# Altium project CPU_Board.PrjPCB (part 1 of 2)
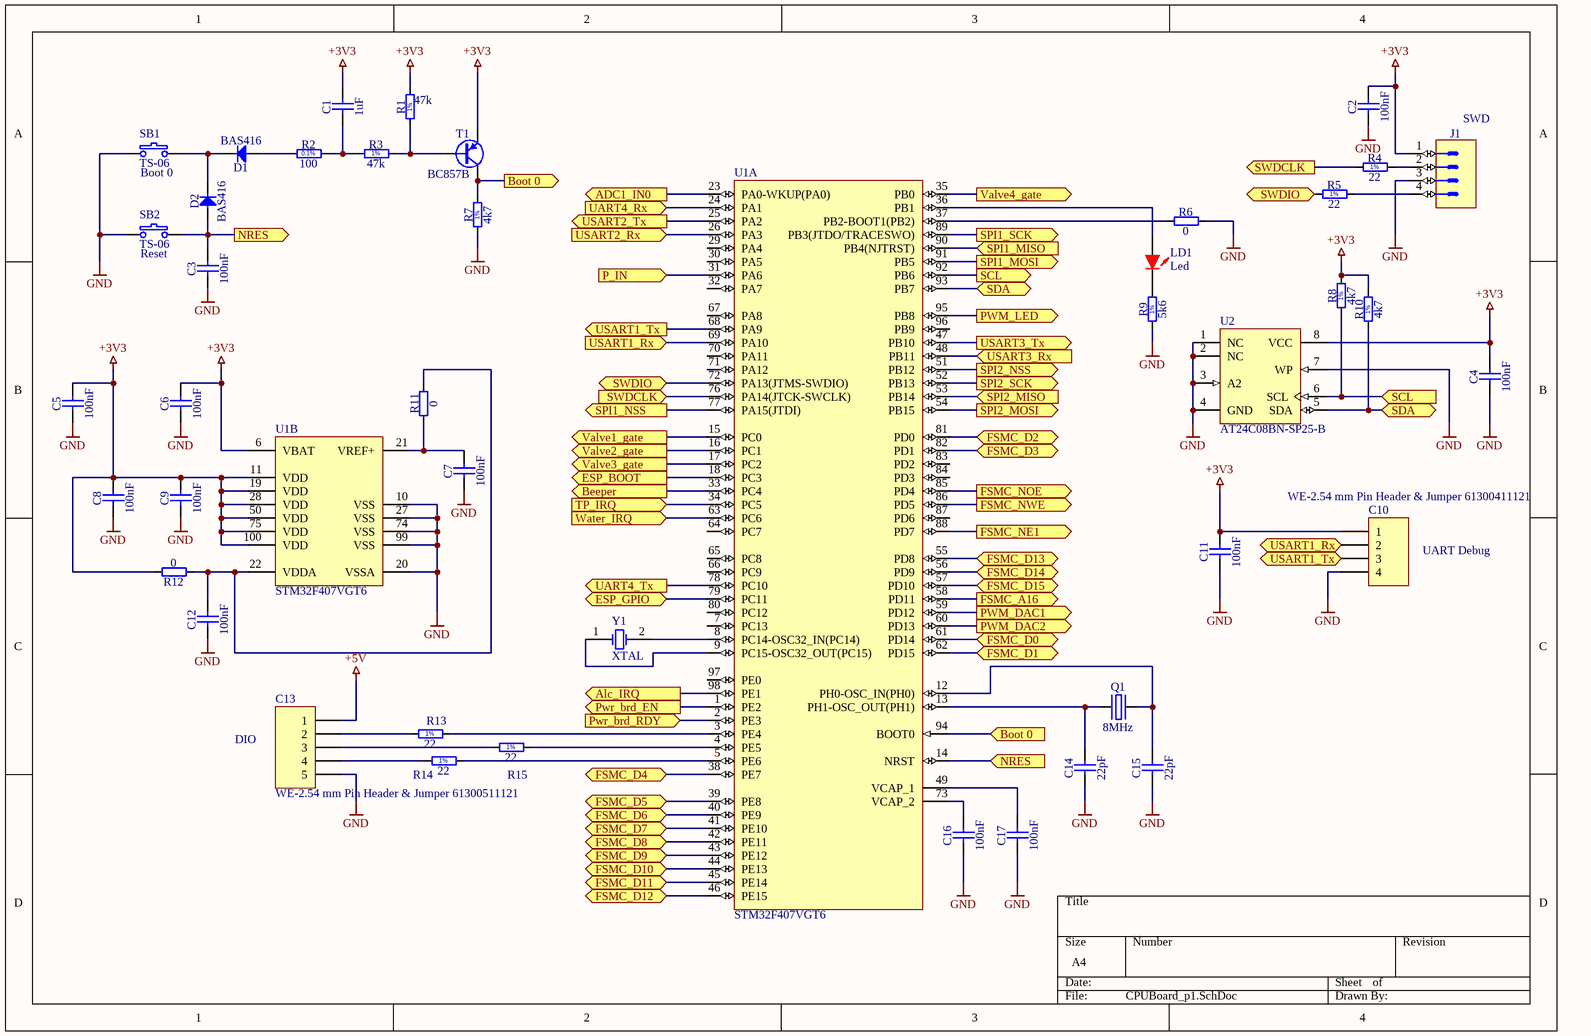
[diagram p0: CPUBoard_p1.SchDoc]
3 sheets, 146 parts. Net scope: flat (ports and power ports of the same name join across sheets).
Board file: Control_CPUBoard_PCB.PcbDoc
Sheets:
  CPUBoard_p1.SchDoc
  CPUBoard_p2.SchDoc
  CPUBoard_p3.SchDoc

## Sheet CPUBoard_p1.SchDoc
size A4

### Parts
C1  1uF  [CAPC2012X140N]
C2  100nF  [CAPC2012X135N]
C3  100nF  [CAPC2012X135N]
C4  100nF  [CAPC2012X135N]
C5  100nF  [CAPC2012X135N]
C6  100nF  [CAPC2012X135N]
C7  100nF  [CAPC2012X135N]
C8  100nF  [CAPC2012X135N]
C9  100nF  [CAPC2012X135N]
C10  WE-2.54 mm Pin Header & Jumper 61300411121  [61300411121]
C11  100nF  [CAPC2012X135N]
C12  100nF  [CAPC2012X135N]
C13  WE-2.54 mm Pin Header & Jumper 61300511121  [61300511121]
C14  22pF  [CAPC2012X135N]
C15  22pF  [CAPC2012X135N]
C16  100nF  [CAPC2012X135N]
C17  100nF  [CAPC2012X135N]
D1  BAS416  [SOD2512X110N]
D2  BAS416  [SOD2512X110N]
J1  KK®  [MOLEX_22-27-2041]  (value not drawn)
LD1  Led  [Led 0805-Red]
Q1  8MHz  [XTAL_HC-49/U-S]
R1  47k  [RESC2012X60N]
R2  100  [RESC2012X60N]
R3  47k  [RESC2012X60N]
R4  22  [RESC2012X60N]
R5  22  [RESC2012X60N]
R6  0  [RESC2012X60N]
R7  4k7  [RESC2012X60N]
R8  4k7  [RESC2012X60N]
R9  5k6  [RESC2012X60N]
R10  4k7  [RESC2012X60N]
R11  0  [RESC2012X60N]
R12  0  [RESC2012X60N]
R13  22  [RESC2012X60N]
R14  22  [RESC2012X60N]
R15  22  [RESC2012X60N]
SB1  TS-06  [TS-06]
SB2  TS-06  [TS-06]
T1  BC857B  [SOT95P230X110-3N]
U1  STM32F407VGT6  [STM-LQFP100_N]  (parts A,B of 2)
U2  AT24C08BN-SP25-B  [8S1_N]
Y1  XTAL  [R38]

### Ports
ADC1_IN0 (out), Alc_IRQ (out), Beeper (out), Boot 0 (in), Boot 0 (out), ESP_BOOT (out), ESP_GPIO (bidir), FSMC_A16 (out), FSMC_D0 (bidir), FSMC_D1 (bidir), FSMC_D2 (bidir), FSMC_D3 (bidir), FSMC_D4 (bidir), FSMC_D5 (bidir), FSMC_D6 (bidir), FSMC_D7 (bidir), FSMC_D8 (bidir), FSMC_D9 (bidir), FSMC_D10 (bidir), FSMC_D11 (bidir), FSMC_D12 (bidir), FSMC_D13 (bidir), FSMC_D14 (bidir), FSMC_D15 (bidir), FSMC_NE1 (out), FSMC_NOE (out), FSMC_NWE (out), NRES (in), NRES (out), P_IN (in), PWM_DAC1 (out), PWM_DAC2 (out), PWM_LED (out), Pwr_brd_EN (out), Pwr_brd_RDY (in), SCL (in), SCL (out), SDA (bidir), SPI1_MISO (in), SPI1_MOSI (out), SPI1_NSS (out), SPI1_SCK (out), SPI2_MISO (in), SPI2_MOSI (out), SPI2_NSS (out), SPI2_SCK (out), SWDCLK (in), SWDCLK (out), SWDIO (bidir), TP_IRQ (in), UART4_Rx (in), UART4_Tx (out), USART1_Rx (in), USART1_Rx (out), USART1_Tx (in), USART1_Tx (out), USART2_Rx (in), USART2_Tx (out), USART3_Rx (in), USART3_Tx (out), Valve1_gate (out), Valve2_gate (out), Valve3_gate (out), Valve4_gate (out), Water_IRQ (in)

### Nets
+3V3: C1.2 C2.2 C4.2 C5.2 C6.2 C8.2 C9.2 C10.1 C11.2 J1.1 R1.2 R8.2 R10.2 R12.2 T1.2(E) U1.6(VBAT) U1.11(VDD) U1.19(VDD) U1.28(VDD) U1.50(VDD) U1.75(VDD) U1.100(VDD) U2.8(VCC)
+5V: C13.1
GND: C2.1 C3.1 C4.1 C5.1 C6.1 C7.1 C8.1 C9.1 C10.4 C11.1 C12.1 C13.5 C14.1 C15.1 C16.1 C17.1 J1.3 R6.2 R7.1 R9.1 SB1.1 SB2.1 U1.10(VSS) U1.20(VSSA) U1.27(VSS) U1.74(VSS) U1.99(VSS) U2.1(NC) U2.2(NC) U2.3(A2) U2.4(GND) U2.7(WP)
NetC1_1: C1.1 R2.2 R3.1
NetC3_2: C3.2 D2.2(A) SB2.2 U1.14(NRST) ; port NRES
NetC7_2: C7.2 R11.1 U1.21(VREF+)
NetC10_2: C10.2 U1.69(PA10) ; port USART1_Rx
NetC10_3: C10.3 U1.68(PA9) ; port USART1_Tx
NetC12_2: C12.2 R11.2 R12.1 U1.22(VDDA)
NetC13_2: C13.2 R13.1
NetC13_3: C13.3 R15.1
NetC13_4: C13.4 R14.1
NetC14_2: C14.2 Q1.1(OSC1) U1.13(PH1-OSC_OUT(PH1))
NetC15_2: C15.2 Q1.2(OSC2) U1.12(PH0-OSC_IN(PH0))
NetC16_2: C16.2 U1.73(VCAP_2)
NetC17_2: C17.2 U1.49(VCAP_1)
NetC20_2: U1.23(PA0-WKUP(PA0)) ; port ADC1_IN0
NetD1_1: D1.1(C) D2.1(C) SB1.2
NetD1_2: D1.2(A) R2.1
NetD4_1: U1.25(PA2) ; port USART2_Tx
NetD4_2: U1.26(PA3) ; port USART2_Rx
NetH2_2: U1.61(PD14) ; port FSMC_D0
NetH2_4: U1.62(PD15) ; port FSMC_D1
NetH2_6: U1.81(PD0) ; port FSMC_D2
NetH2_7: U1.58(PD11) ; port FSMC_A16
NetH2_8: U1.82(PD1) ; port FSMC_D3
NetH2_9: U1.86(PD5) ; port FSMC_NWE
NetH2_10: U1.38(PE7) ; port FSMC_D4
NetH2_11: U1.85(PD4) ; port FSMC_NOE
NetH2_12: U1.39(PE8) ; port FSMC_D5
NetH2_13: U1.42(PE11) ; port FSMC_D8
NetH2_14: U1.40(PE9) ; port FSMC_D6
NetH2_15: U1.43(PE12) ; port FSMC_D9
NetH2_16: U1.41(PE10) ; port FSMC_D7
NetH2_17: U1.44(PE13) ; port FSMC_D10
NetH2_18: U1.89(PB3(JTDO/TRACESWO)) ; port SPI1_SCK
NetH2_19: U1.45(PE14) ; port FSMC_D11
NetH2_20: U1.77(PA15(JTDI)) ; port SPI1_NSS
NetH2_21: U1.46(PE15) ; port FSMC_D12
NetH2_22: U1.91(PB5) ; port SPI1_MOSI
NetH2_23: U1.55(PD8) ; port FSMC_D13
NetH2_25: U1.56(PD9) ; port FSMC_D14
NetH2_26: U1.90(PB4(NJTRST)) ; port SPI1_MISO
NetH2_27: U1.57(PD10) ; port FSMC_D15
NetH2_28: U1.34(PC5) ; port TP_IRQ
NetH2_29: U1.88(PD7) ; port FSMC_NE1
NetH3_1: U1.24(PA1) ; port UART4_Rx
NetH3_4: U1.79(PC11) ; port ESP_GPIO
NetH3_6: U1.18(PC3) ; port ESP_BOOT
NetH3_8: U1.78(PC10) ; port UART4_Tx
NetIC1_6: U1.31(PA6) ; port P_IN
NetJ1_2: J1.2 R4.2
NetJ1_4: J1.4 R5.2
NetJ6_4: U1.15(PC0) ; port Valve1_gate
NetJ6_5: U1.16(PC1) ; port Valve2_gate
NetJ6_6: U1.17(PC2) ; port Valve3_gate
NetJ6_7: U1.35(PB0) ; port Valve4_gate
NetLD1_1: LD1.1(A) U1.36(PB1)
NetLD1_2: LD1.2(K) R9.2
NetR1_1: R1.1 R3.2 T1.1(B)
NetR4_1: R4.1 U1.76(PA14(JTCK-SWCLK)) ; port SWDCLK
NetR5_1: R5.1 U1.72(PA13(JTMS-SWDIO)) ; port SWDIO
NetR6_1: R6.1 U1.37(PB2-BOOT1(PB2))
NetR7_2: R7.2 T1.3(C) U1.94(BOOT0) ; port Boot 0
NetR8_1: R8.1 U1.92(PB6) U2.6(SCL) ; port SCL
NetR10_1: R10.1 U1.93(PB7) U2.5(SDA) ; port SDA
NetR13_2: R13.2 U1.3(PE4)
NetR14_2: R14.2 U1.5(PE6)
NetR15_2: R15.2 U1.4(PE5)
NetR18_1: U1.98(PE1) ; port Alc_IRQ
NetR21_1: U1.63(PC6) ; port Water_IRQ
NetR25_1: U1.60(PD13) ; port PWM_DAC2
NetR29_1: U1.48(PB11) ; port USART3_Rx
NetR30_1: U1.2(PE3) ; port Pwr_brd_RDY
NetR31_1: U1.47(PB10) ; port USART3_Tx
NetR32_1: U1.95(PB8) ; port PWM_LED
NetR33_1: U1.33(PC4) ; port Beeper
NetR34_1: U1.1(PE2) ; port Pwr_brd_EN
NetR49_1: U1.59(PD12) ; port PWM_DAC1
NetU1_8: U1.8(PC14-OSC32_IN(PC14)) Y1.2(OSC2)
NetU1_9: U1.9(PC15-OSC32_OUT(PC15)) Y1.1(OSC1)
NetU1_51: U1.51(PB12) ; port SPI2_NSS
NetU1_52: U1.52(PB13) ; port SPI2_SCK
NetU1_53: U1.53(PB14) ; port SPI2_MISO
NetU1_54: U1.54(PB15) ; port SPI2_MOSI

Not connected (* = marked no-connect by the designer): U1 7(PC13) 29(PA4) 30(PA5) 32(PA7) 64(PC7) 65(PC8) 66(PC9) 67(PA8) 70(PA11) 71(PA12) 80(PC12) 83(PD2) 84(PD3) 87(PD6) 96(PB9) 97(PE0)

### Notes on the sheet
- (near SB1) Boot 0
- (near J1) SWD
- (near SB2) Reset
- UART Debug
- DIO
- (in symbol R0805_4K7_1%_0.125W_100PPM) 1%
- (in symbol R0805_5K6_1%_0.125W_100PPM) 1%
- (in symbol R0805_22R_1%_0.125W_100PPM) 1%
- (in symbol R0805_47K_1%_0.125W_100PPM) 1%
- (in symbol R0805_100R_0.1%_0.1W_10PPM) 0.1%

### Library data of the parts
C1 = CC0805_1UF_35V_20%_X7R: Non-polarised capacitor; Part Description: SMD Multilayer Chip Ceramic Capacitor; Manufacturer: GENERIC; Manufacturer1 Part Number: GMK212B7105MG-T; Voltage: 35V; TC: X7R; Tolerance: ±20%; Table: Capacitors SMD; Part Number: CC0805_1UF_35V_20%_X7R; Component Kind: Standard; Component Type: Standard; Pin Count: 2; Value: 1uF; Status: Not Recommended; Manufacturer Part Number: CC0805_1UF_35V_20%_X7R; Case: 0805; Mounted: Yes; Socket: No; SMD: Yes; Manufacturer1 Example: TAIYO YUDEN; Manufacturer1 ComponentHeight: 1.35mm; HelpURL: \\cern.ch\dfs\Applications\Altium\Datasheets\CC0805_X7R_TAIYO-YUDEN_HIGH-VALUE.pdf; Author: CERN DEM JLC; CreateDate: 22.06.2011; LatestRevisionDate: 22.06.2011
C2-C9 C11 C12 C16 C17 = CC0805_100NF_50V_10%_X7R: Non-polarised capacitor; Part Description: SMD Multilayer Chip Ceramic Capacitor; Manufacturer: GENERIC; Manufacturer1 Part Number: B37941K5104K62; Voltage: 50V; TC: X7R; Tolerance: ±10%; Table: Capacitors SMD; Part Number: CC0805_100NF_50V_10%_X7R; Component Kind: Standard; Component Type: Standard; Pin Count: 2; Value: 100nF; Status: Preferred; Manufacturer Part Number: CC0805_100NF_50V_10%_X7R; Case: 0805; Mounted: Yes; Socket: No; SMD: Yes; Manufacturer1 Example: EPCOS; Manufacturer1 ComponentHeight: 1.35mm; HelpURL: \\cern.ch\dfs\Applications\Altium\Datasheets\CC0805_X7R_EPCOS.pdf; Author: CERN DEM JLC; CreateDate: 03.12.2007; LatestRevisionDate: 03.12.2007
C10 = WE-2.54 mm Pin Header & Jumper 61300411121: WR-PHD 2.54mm Pin Header; Manufacturer: WЁ№rth Elektronik eiSos GmbH; ComponentLink1 Description: Manufacturer; ComponentLink2 Description: Datasheet; NoPins: 04; Created Date: 22 March 2013; partNo: 61300411121; ComponentLink1URL: http://www.we-online.com; ComponentLink2URL: http://katalog.we-online.de/em/datasheet/6130xx11121.pdf; Created by: Karrer Zheng
C13 = WE-2.54 mm Pin Header & Jumper 61300511121: WR-PHD 2.54mm Pin Header; Manufacturer: WЁ№rth Elektronik eiSos GmbH; ComponentLink1 Description: Manufacturer; ComponentLink2 Description: Datasheet; NoPins: 05; Created Date: 22 March 2013; partNo: 61300511121; ComponentLink1URL: http://www.we-online.com; ComponentLink2URL: http://katalog.we-online.de/em/datasheet/6130xx11121.pdf; Created by: Karrer Zheng
C14 C15 = CC0805_22PF_50V_5%_NP0: Non-polarised capacitor; Part Description: SMD Multilayer Chip Ceramic Capacitor; Manufacturer: GENERIC; Manufacturer1 Part Number: 223886115229; Voltage: 50V; TC: NP0; Tolerance: ±5%; Table: Capacitors SMD; Part Number: CC0805_22PF_50V_5%_NP0; Component Kind: Standard; Component Type: Standard; Pin Count: 2; Value: 22pF; Status: Preferred; Manufacturer Part Number: CC0805_22PF_50V_5%_NP0; Case: 0805; Mounted: Yes; Socket: No; SMD: Yes; Manufacturer1 Example: PHYCOMP; Manufacturer1 ComponentHeight: 1.35mm; HelpURL: \\cern.ch\dfs\Applications\Altium\Datasheets\CC0805_NP0_PHYCOMP.pdf; Author: CERN DEM JLC; CreateDate: 03.12.2007; LatestRevisionDate: 03.12.2007
D1 D2 = BAS416: Diode; Part Description: Low-Leakage Diode; Manufacturer: NXP SEMICONDUCTORS; Voltage: 75V; Power: 200mA; Table: Diodes; Part Number: BAS416; Component Kind: Standard; Component Type: Standard; Device: BAS416; PackageDescription: Small Outline Diode Flat Lead (SOD-323), 1.70mm W X 1.25mm L X 1.10mm H body,  IPC Medium Density; Manufacturer Part Number: BAS416; Pin Count: 2; Case: SOD323; Mounted: Yes; Socket: No; SMD: Yes; ComponentHeight: 1.1mm; HelpURL: \\cern.ch\dfs\Applications\Altium\Datasheets\BAS416.pdf; Author: CERN DEM JLC; CreateDate: 01.10.2013; LatestRevisionDate: 01.10.2013
J1 = MOLEX_22-27-2041: Connector 4 Male; Part Description: 2.54mm (.100") Pitch KK® Wire-to-Board Header, Vertical, with Friction Lock, 4 Circuits, Tin (Sn) Plating; Manufacturer: MOLEX; Part Number: MOLEX_22-27-2041; Component Kind: Standard; Component Type: Standard; Pin Count: 4; Family: KK®; Mounted: Yes; Socket: No; SMD: No; Status: None; Manufacturer Part Number: 22-27-2041; ComponentHeight: 11.7mm; HelpURL: \\cern.ch\dfs\Applications\Altium\Datasheets\MOLEX_22-27-2041.pdf; Author: CERN DEM JLC; CreateDate: 04.12.2008; LatestRevisionDate: 04.12.2008; Table: MOLEX
LD1 = Led 0805 KP-2012EC: Red  627nm 12mcd; Price: 0.09
Q1 = XTAL_5MHZ_CITIZEN_HC49US5.000MABJ-UB: Quartz Crystal; Part Description: Tolerance:± 30ppm, Stability:± 50ppm, -10°C to +60°C, 18pF, Quartz Crystal, HC-49/U-S Serie; Manufacturer: CITIZEN FINETECH MIYOTA CO; Table: Crystals & Oscillators; Part Number: XTAL_5MHZ_CITIZEN_HC49US5.000MABJ-UB; Component Kind: Standard; Component Type: Standard; PackageDescription: HC-49/U-S Leaded Cristal, Body 11.5x4.66mm; Pitch 4.88mm; Value: 8MHz; Manufacturer Part Number: HC49US5.000MABJ-UB; Pin Count: 2; Mounted: Yes; Socket: No; SMD: No; ComponentHeight: 3.5mm; HelpURL: \\cern.ch\dfs\Applications\Altium\Datasheets\XTAL_CITIZEN_HC-49-U-S.pdf; Author: CERN DEM JLC; CreateDate: 27.11.2012; LatestRevisionDate: 27.11.2012
R1 R3 = R0805_47K_1%_0.125W_100PPM: Resistor - 1%; Part Description: General Purpose Thick Film Chip Resistor; Manufacturer: GENERIC; Manufacturer1 Part Number: NRC10F4702TRF; Power: 0.125W; TC: ±100ppm/°C; Table: Resistors SMD; Part Number: R0805_47K_1%_0.125W_100PPM; Component Kind: Standard; Component Type: Standard; Pin Count: 2; Value: 47k; Status: Preferred; Tolerance: ±1%; Manufacturer Part Number: R0805_47K_1%_0.125W_100PPM; Case: 0805; Mounted: Yes; Socket: No; SMD: Yes; Manufacturer1 Example: NIC COMPONENT; Manufacturer1 ComponentHeight: 0.6mm; HelpURL: \\cern.ch\dfs\Applications\Altium\Datasheets\R0805_NIC_NRC.pdf; Author: CERN DEM JLC; CreateDate: 03.12.2007; LatestRevisionDate: 13.03.2008
R2 = R0805_100R_0.1%_0.1W_10PPM: Resistor - 0.1%; Part Description: Thin Film Chip Resistor; Manufacturer: GENERIC; Manufacturer1 Part Number: RN73C2A100RBTG; Power: 0.1W; TC: ±10ppm; Table: Resistors SMD; Part Number: R0805_100R_0.1%_0.1W_10PPM; Component Kind: Standard; Component Type: Standard; Pin Count: 2; Value: 100; Status: Not recommended; Tolerance: ±0.1%; Manufacturer Part Number: R0805_100R_0.1%_0.1W_10PPM; Case: 0805; Mounted: Yes; Socket: No; SMD: Yes; Manufacturer1 Example: TYCO HOLSWORTHY; Manufacturer1 ComponentHeight: 0.6mm; HelpURL: \\cern.ch\dfs\Applications\Altium\Datasheets\R0805_Tyco_RN73.pdf; Author: CERN DEM JLC; CreateDate: 03.12.2007; LatestRevisionDate: 13.03.2008
R4 R5 R13-R15 = R0805_22R_1%_0.125W_100PPM: Resistor - 1%; Part Description: General Purpose Thick Film Chip Resistor; Manufacturer: GENERIC; Manufacturer1 Part Number: NRC10F22R0TRF; Power: 0.125W; TC: ±100ppm/°C; Table: Resistors SMD; Part Number: R0805_22R_1%_0.125W_100PPM; Component Kind: Standard; Component Type: Standard; Pin Count: 2; Value: 22; Status: Preferred; Tolerance: ±1%; Manufacturer Part Number: R0805_22R_1%_0.125W_100PPM; Case: 0805; Mounted: Yes; Socket: No; SMD: Yes; Manufacturer1 Example: NIC COMPONENT; Manufacturer1 ComponentHeight: 0.6mm; HelpURL: \\cern.ch\dfs\Applications\Altium\Datasheets\R0805_NIC_NRC.pdf; Author: CERN DEM JLC; CreateDate: 03.12.2007; LatestRevisionDate: 13.03.2008
R6 R11 R12 = R0805_0R_JUMPER: Resistor; Part Description: 2A (0.05R Max DC Resistance) Zero Ohm Jumper; Manufacturer: GENERIC; Manufacturer1 Part Number: NRC10Z0; Table: Resistors SMD; Part Number: R0805_0R_JUMPER; Component Kind: Standard; Component Type: Standard; Pin Count: 2; Value: 0; Status: Preferred; Manufacturer Part Number: R0805_0R_JUMPER; Case: 0805; Mounted: Yes; Socket: No; SMD: Yes; Manufacturer1 Example: NIC COMPONENT; Manufacturer1 ComponentHeight: 0.6mm; HelpURL: \\cern.ch\dfs\Applications\Altium\Datasheets\R0805_NIC_NRC.pdf; Author: CERN DEM JLC; CreateDate: 03.12.2007; LatestRevisionDate: 13.03.2008
R7 R8 R10 = R0805_4K7_1%_0.125W_100PPM: Resistor - 1%; Part Description: General Purpose Thick Film Chip Resistor; Manufacturer: GENERIC; Manufacturer1 Part Number: NRC10F4701TRF; Power: 0.125W; TC: ±100ppm/°C; Table: Resistors SMD; Part Number: R0805_4K7_1%_0.125W_100PPM; Component Kind: Standard; Component Type: Standard; Pin Count: 2; Value: 4k7; Status: Preferred; Tolerance: ±1%; Manufacturer Part Number: R0805_4K7_1%_0.125W_100PPM; Case: 0805; Mounted: Yes; Socket: No; SMD: Yes; Manufacturer1 Example: NIC COMPONENT; Manufacturer1 ComponentHeight: 0.6mm; HelpURL: \\cern.ch\dfs\Applications\Altium\Datasheets\R0805_NIC_NRC.pdf; Author: CERN DEM JLC; CreateDate: 03.12.2007; LatestRevisionDate: 13.03.2008
R9 = R0805_5K6_1%_0.125W_100PPM: Resistor - 1%; Part Description: General Purpose Thick Film Chip Resistor; Manufacturer: GENERIC; Manufacturer1 Part Number: NRC10F5601TRF; Power: 0.125W; TC: ±100ppm/°C; Table: Resistors SMD; Part Number: R0805_5K6_1%_0.125W_100PPM; Component Kind: Standard; Component Type: Standard; Pin Count: 2; Value: 5k6; Status: Preferred; Tolerance: ±1%; Manufacturer Part Number: R0805_5K6_1%_0.125W_100PPM; Case: 0805; Mounted: Yes; Socket: No; SMD: Yes; Manufacturer1 Example: NIC COMPONENT; Manufacturer1 ComponentHeight: 0.6mm; HelpURL: \\cern.ch\dfs\Applications\Altium\Datasheets\R0805_NIC_NRC.pdf; Author: CERN DEM JLC; CreateDate: 03.12.2007; LatestRevisionDate: 13.03.2008
SB1 SB2 = Buton TS-06: Price: 0.15
T1 = BC857B: PNP Transistor; Part Description: 45V 100mA PNP general-purpose transistors; Manufacturer: NXP SEMICONDUCTORS; Table: Transistors; Part Number: BC857B; Component Kind: Standard; Component Type: Standard; Device: BC857B; PackageDescription: SOT23, 3 pin, Pitch 0.95mm - 1.3mm W X 2.9mm L X 1.1mm H, IPC Medium Density; Manufacturer Part Number: BC857B; Pin Count: 3; Case: SOT23-3; Mounted: Yes; Socket: No; SMD: Yes; ComponentHeight: 1.1mm; HelpURL: \\cern.ch\dfs\Applications\Altium\Datasheets\BC857B.pdf; Author: CERN DEM JLC; CreateDate: 14.06.2011; LatestRevisionDate: 14.06.2011
U1 = STM32F407VGT6: ARM Cortex-M4 32-bit MCU+FPU, 210 DMIPS, 1024 kB Flash, 192 kB Internal RAM, 82 I/Os, 100-pin LQFP, -40 to 85 degC, Tray; Manufacturer: STMicroelectronics; D/A Converter: 2x12-bit; FLASH Size (Prog) (kB): 1024; I/Os (High Current): 82; Internal RAM Size (kB): 192; Operating Frequency(F) (Processor speed) (MHz): 168; Supply Voltage(Vcc) max (V): 3.6; Supply Voltage(Vcc) min (V): 1.8; DatasheetVersion: Rev. 4; PackageVersion: Rev. 1, 06/2013; PackageReference: LQFP100; PackageDescription: 100-Pin Low Profile Quad Flat Package, 14 x 14 mm Body, 0.5 mm Pitch; Supplier 1: Digi-Key; Supplier Part Number 1: 497-11605-ND; Supplier 2: Farnell; Supplier Part Number 2: 2064368; Supplier 3: Newark; Supplier Part Number 3: 73T2333; Supplier 4: Mouser; Supplier Part Number 4: 511-STM32F407VGT6; Core: ARM Cortex-M4; Packing: Tray; Mounting Technology: Surface Mount; PartNumber: STM32F407VGT6; ComponentLink1Description: Manufacturer URL; ComponentLink1URL: http://www.st.com/web/en/home.html; ComponentLink2Description: Datasheet; ComponentLink2URL: http://www.st.com/st-web-ui/static/active/en/resource/technical/document/datasheet/DM00037051.pdf; ComponentLink3Description: Package Specification; ComponentLink3URL: http://www.st.com/st-web-ui/static/active/en/resource/technical/document/data_brief/DM00071938.pdf
U2 = AT24C08BN-SP25-B: 8Kbit (1024 x 8), 2-wire Bus Automotive Serial EEPROM with Write Protect, 2.5V, 8-Pin SOIC, Bulk; DatasheetVersion: 8517C,  Jan-2009; PackageVersion: revC, Mar-2005; PackageReference: 8S1; PackageDescription: 8-Lead (0.150" Wide Body), Plastic Gull Wing Small Outline (JEDEC SOIC); Code_JEDEC: MS-012-AA; Code_IPC: SOIC127P600-8; ComponentLink1Description: Manufacturer URL; ComponentLink1URL: http://www.atmel.com/; ComponentLink2Description: Datasheet; ComponentLink2URL: http://www.atmel.com/dyn/resources/prod_documents/doc8517.pdf
Y1 = XTAL: Crystal Oscillator; Published: 8-Jun-2000; LatestRevisionDate: 17-Jul-2002; LatestRevisionNote: Re-released for DXP Platform.; PackageReference: R38; Publisher: Altium Limited; PackageDescription: Crystal, Thru-Hole; 2 Leads; Body 3.1 x 8.2 mm (Dia.xH)

## Sheet CPUBoard_p2.SchDoc
size A4
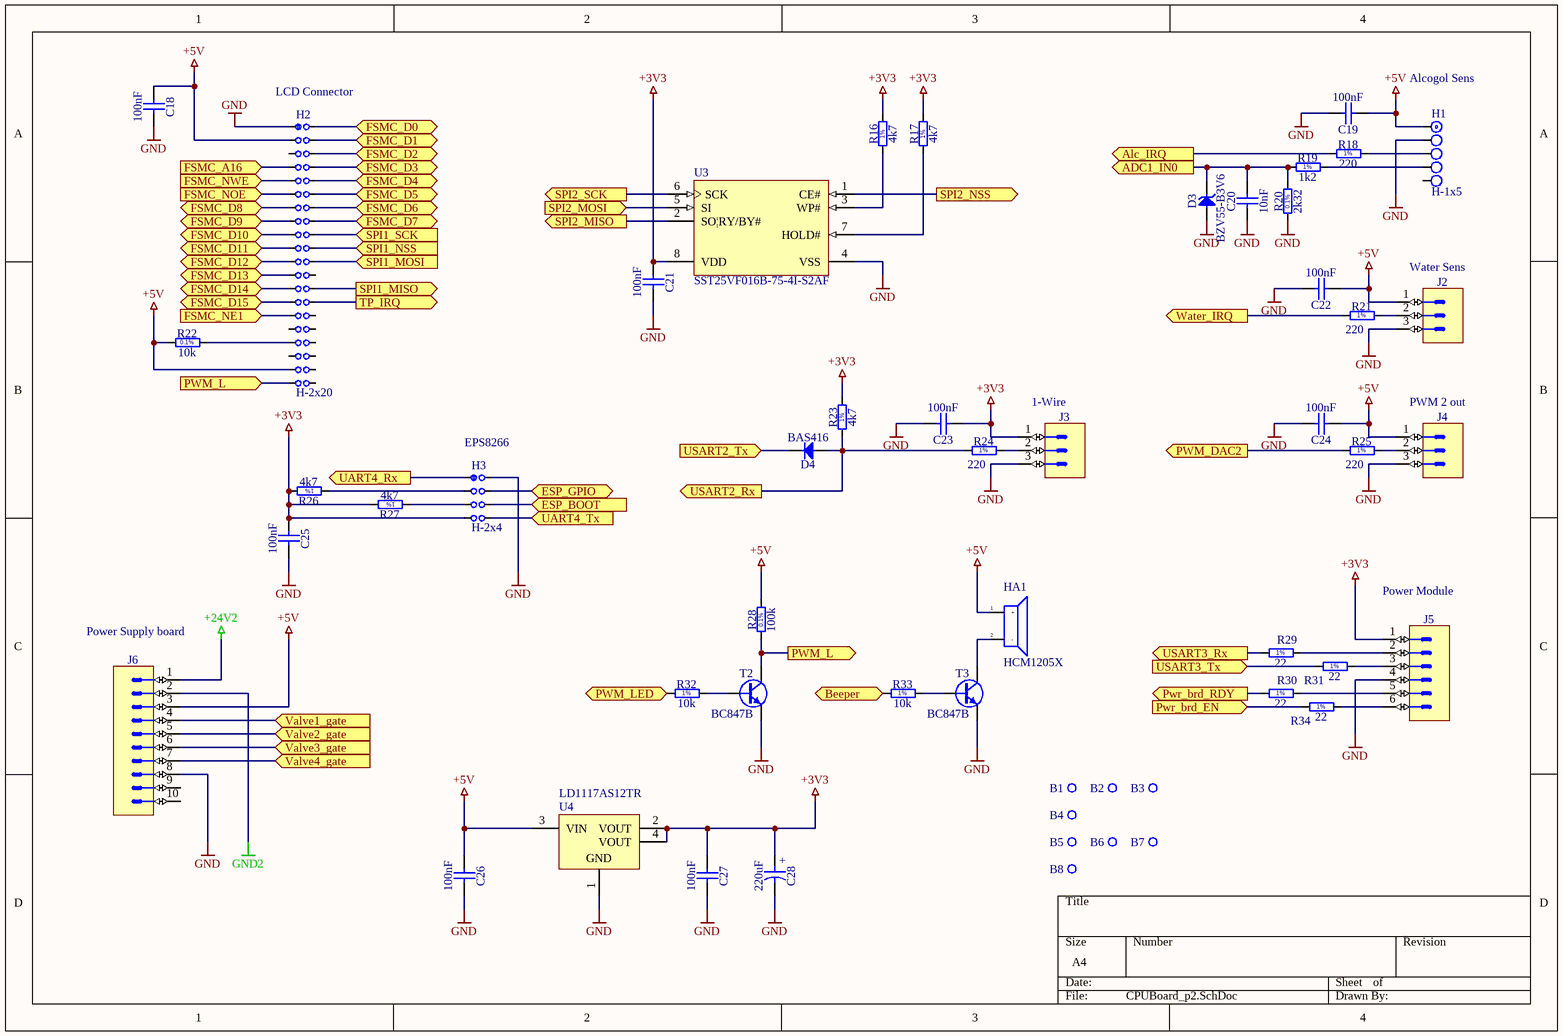
[diagram p1: CPUBoard_p2.SchDoc]

### Parts
B1  Plated Hole  [MTG350_650]  (value not drawn)
B2  Plated Hole  [MTG350_650]  (value not drawn)
B3  Plated Hole  [MTG350_650]  (value not drawn)
B4  Plated Hole  [MTG350_650]  (value not drawn)
B5  Plated Hole  [MTG350_650]  (value not drawn)
B6  Plated Hole  [MTG350_650]  (value not drawn)
B7  Plated Hole  [MTG350_650]  (value not drawn)
B8  Plated Hole  [MTG350_650]  (value not drawn)
C18  100nF  [CAPC2012X135N]
C19  100nF  [CAPC2012X135N]
C20  10nF  [CAPC2012X135N]
C21  100nF  [CAPC2012X135N]
C22  100nF  [CAPC2012X135N]
C23  100nF  [CAPC2012X135N]
C24  100nF  [CAPC2012X135N]
C25  100nF  [CAPC2012X135N]
C26  100nF  [CAPC2012X135N]
C27  100nF  [CAPC2012X135N]
C28  220uF  [CAPPR350-850X1300]
D3  BZV55-B3V6  [DIOMELF3515N]
D4  BAS416  [SOD2512X110N]
H1  H-1x5  [J1x5]
H2  H-2x20  [J2x20]
H3  H-2x4  [J2x4]
HA1  HCM1205X  [HCM1205X]
J2  KK®  [MOLEX_22-04-1031]  (value not drawn)
J3  KK®  [MOLEX_22-04-1031]  (value not drawn)
J4  KK®  [MOLEX_22-04-1031]  (value not drawn)
J5  KK®  [MOLEX_22-27-2061]  (value not drawn)
J6  C-Grid®  [MOLEX_70246-1004]  (value not drawn)
R16  4k7  [RESC2012X60N]
R17  4k7  [RESC2012X60N]
R18  220  [RESC2012X60N]
R19  1k2  [RESC2012X60N]
R20  2k32  [RESC2012X60N]
R21  220  [RESC2012X60N]
R22  10k  [RESC2012X60N]
R23  4k7  [RESC2012X60N]
R24  220  [RESC2012X60N]
R25  220  [RESC2012X60N]
R26  4k7  [RESC2012X60N]
R27  4k7  [RESC2012X60N]
R28  100k  [RESC2012X60N]
R29  22  [RESC2012X60N]
R30  22  [RESC2012X60N]
R31  22  [RESC2012X60N]
R32  10k  [RESC2012X60N]
R33  10k  [RESC2012X60N]
R34  22  [RESC2012X60N]
T2  BC847B  [SOT95P230X110-3N]
T3  BC847B  [SOT95P230X110-3N]
U3  SST25VF016B-75-4I-S2AF  [MCHP-SOIC-S2A8_N]
U4  LD1117AS12TR  [SOT-223_N]

### Ports
ADC1_IN0 (out), Alc_IRQ (out), Beeper (in), ESP_BOOT (in), ESP_GPIO (bidir), FSMC_A16 (in), FSMC_D0 (bidir), FSMC_D1 (bidir), FSMC_D2 (bidir), FSMC_D3 (bidir), FSMC_D4 (bidir), FSMC_D5 (bidir), FSMC_D6 (bidir), FSMC_D7 (bidir), FSMC_D8 (bidir), FSMC_D9 (bidir), FSMC_D10 (bidir), FSMC_D11 (bidir), FSMC_D12 (bidir), FSMC_D13 (bidir), FSMC_D14 (bidir), FSMC_D15 (bidir), FSMC_NE1 (in), FSMC_NOE (in), FSMC_NWE (in), PWM_DAC2 (out), PWM_L (in), PWM_L (out), PWM_LED (in), Pwr_brd_EN (in), Pwr_brd_RDY (out), SPI1_MISO (out), SPI1_MOSI (in), SPI1_NSS (in), SPI1_SCK (in), SPI2_MISO (out), SPI2_MOSI (in), SPI2_NSS (out), SPI2_SCK (out), TP_IRQ (out), UART4_Rx (out), UART4_Tx (in), USART2_Rx (out), USART2_Tx (in), USART3_Rx (out), USART3_Tx (in), Valve1_gate (in), Valve2_gate (in), Valve3_gate (in), Valve4_gate (in), Water_IRQ (out)

### Nets
+3V3: C21.1 C23.1 C25.1 C27.1 C28.1 H3.7 J3.1 J5.1 R16.2 R17.2 R23.2 R26.2 R27.2 U3.8(VDD) U4.2(VOUT) U4.4(VOUT)
+5V: C18.1 C19.1 C22.1 C24.1 C26.1 H1.1 H2.3 H2.37 HA1.1(+) J2.1 J4.1 J6.3 R22.1 R28.2 U4.3(VIN)
+24V2: J6.1
GND: C18.2 C19.2 C20.1 C21.2 C22.2 C23.2 C24.2 C25.2 C26.2 C27.2 C28.2 D3.2(A) H1.2 H2.1 H3.2 J2.3 J3.3 J4.3 J5.4 J6.8 R20.1 T2.2(E) T3.2(E) U3.4(VSS) U4.1(GND)
GND2: J6.2
NetC20_2: C20.2 D3.1(C) R19.1 R20.2 ; port ADC1_IN0
NetD4_1: D4.1(C) ; port USART2_Tx
NetD4_2: D4.2(A) R23.1 R24.1 ; port USART2_Rx
NetH1_3: H1.3 R18.2
NetH1_4: H1.4 R19.2
NetH2_2: H2.2 ; port FSMC_D0
NetH2_4: H2.4 ; port FSMC_D1
NetH2_6: H2.6 ; port FSMC_D2
NetH2_7: H2.7 ; port FSMC_A16
NetH2_8: H2.8 ; port FSMC_D3
NetH2_9: H2.9 ; port FSMC_NWE
NetH2_10: H2.10 ; port FSMC_D4
NetH2_11: H2.11 ; port FSMC_NOE
NetH2_12: H2.12 ; port FSMC_D5
NetH2_13: H2.13 ; port FSMC_D8
NetH2_14: H2.14 ; port FSMC_D6
NetH2_15: H2.15 ; port FSMC_D9
NetH2_16: H2.16 ; port FSMC_D7
NetH2_17: H2.17 ; port FSMC_D10
NetH2_18: H2.18 ; port SPI1_SCK
NetH2_19: H2.19 ; port FSMC_D11
NetH2_20: H2.20 ; port SPI1_NSS
NetH2_21: H2.21 ; port FSMC_D12
NetH2_22: H2.22 ; port SPI1_MOSI
NetH2_23: H2.23 ; port FSMC_D13
NetH2_25: H2.25 ; port FSMC_D14
NetH2_26: H2.26 ; port SPI1_MISO
NetH2_27: H2.27 ; port FSMC_D15
NetH2_28: H2.28 ; port TP_IRQ
NetH2_29: H2.29 ; port FSMC_NE1
NetH2_33: H2.33 R22.2
NetH2_39: H2.39 R28.1 T2.3(C) ; port PWM_L
NetH3_1: H3.1 ; port UART4_Rx
NetH3_3: H3.3 R26.1
NetH3_4: H3.4 ; port ESP_GPIO
NetH3_5: H3.5 R27.1
NetH3_6: H3.6 ; port ESP_BOOT
NetH3_8: H3.8 ; port UART4_Tx
NetHA1_2: HA1.2(-) T3.3(C)
NetJ2_2: J2.2 R21.2
NetJ3_2: J3.2 R24.2
NetJ4_2: J4.2 R25.2
NetJ5_2: J5.2 R29.2
NetJ5_3: J5.3 R31.2
NetJ5_5: J5.5 R30.2
NetJ5_6: J5.6 R34.2
NetJ6_4: J6.4 ; port Valve1_gate
NetJ6_5: J6.5 ; port Valve2_gate
NetJ6_6: J6.6 ; port Valve3_gate
NetJ6_7: J6.7 ; port Valve4_gate
NetR16_1: R16.1 U3.3(WP#)
NetR17_1: R17.1 U3.7(HOLD#)
NetR18_1: R18.1 ; port Alc_IRQ
NetR21_1: R21.1 ; port Water_IRQ
NetR25_1: R25.1 ; port PWM_DAC2
NetR29_1: R29.1 ; port USART3_Rx
NetR30_1: R30.1 ; port Pwr_brd_RDY
NetR31_1: R31.1 ; port USART3_Tx
NetR32_1: R32.1 ; port PWM_LED
NetR32_2: R32.2 T2.1(B)
NetR33_1: R33.1 ; port Beeper
NetR33_2: R33.2 T3.1(B)
NetR34_1: R34.1 ; port Pwr_brd_EN
NetU1_51: U3.1(CE#) ; port SPI2_NSS
NetU1_52: U3.6(SCK) ; port SPI2_SCK
NetU1_53: U3.2(SO|RY/BY#) ; port SPI2_MISO
NetU1_54: U3.5(SI) ; port SPI2_MOSI

Not connected (* = marked no-connect by the designer): B1 1; B2 1; B3 1; B4 1; B5 1; B6 1; B7 1; B8 1; H1 5; H2 5 24 30 31 32 34 35 36 38 40; J6 9 10

### Notes on the sheet
- (near H2) LCD Connector
- Alcogol Sens
- (near J2) Water Sens
- (near H3) EPS8266
- (near J3) 1-Wire
- (near J4) PWM 2 out
- (near J6) Power Supply board
- (near J5) Power Module
- (in symbol CAER_220UF_25V_20%_RUBYCON_25YXF220M8X11.5) +
- (in symbol R0805_1K2_1%_0.125W_100PPM) 1%
- (in symbol R0805_2K32_0.1%_0.1W_10PPM) 0.1%
- (in symbol R0805_4K7_1%_0.125W_100PPM) 1%
- (in symbol R0805_10K_0.1%_0.1W_10PPM) 0.1%
- (in symbol R0805_10K_1%_0.125W_100PPM) 1%
- (in symbol R0805_22R_1%_0.125W_100PPM) 1%
- (in symbol R0805_100K_0.1%_0.1W_10PPM) 0.1%
- (in symbol R0805_220R_1%_0.125W_100PPM) 1%

### Library data of the parts
B1-B8 = PLATED_HOLE3.5_PAD6.5: Single Terminal Socket; Part Description: Plated Through Hole: Hole Dia.=3.5mm Pad Dia.=6.5mm; Mounted: No; Table: Pads; Part Number: PLATED_HOLE3.5_PAD6.5; Component Kind: Standard (No BOM); Component Type: Standard (No BOM); Pin Count: 1; Family: Plated Hole; Socket: No; SMD: No; Status: None; ComponentHeight: 0mm; Author: CERN DEM JLC; CreateDate: 20.11.2008; LatestRevisionDate: 23.11.2011; PackageDescription: Plated Through Hole: Hole Dia.=3.5mm Pad Dia.=6.5mm
C18 C19 C21-C27 = CC0805_100NF_50V_10%_X7R: as C2 on sheet CPUBoard_p1; Part Number: CC0805_100NF_50V_10%_X7R; Component Kind: Standard; Component Type: Standard; Pin Count: 2; Value: 100nF; Status: Preferred; Manufacturer Part Number: CC0805_100NF_50V_10%_X7R; Case: 0805; Mounted: Yes; Socket: No; SMD: Yes; Manufacturer1 Example: EPCOS; Manufacturer1 ComponentHeight: 1.35mm; HelpURL: \\cern.ch\dfs\Applications\Altium\Datasheets\CC0805_X7R_EPCOS.pdf; Author: CERN DEM JLC; CreateDate: 03.12.2007; LatestRevisionDate: 03.12.2007
C20 = CC0805_10NF_50V_5%_X7R: Non-polarised capacitor; Part Description: SMD Multilayer Chip Ceramic Capacitor; Manufacturer: GENERIC; Manufacturer1 Part Number: 08055C103JAT2A; Voltage: 50V; TC: X7R; Tolerance: ±5%; Table: Capacitors SMD; Part Number: CC0805_10NF_50V_5%_X7R; Component Kind: Standard; Component Type: Standard; Pin Count: 2; Value: 10nF; Status: None; Manufacturer Part Number: CC0805_10NF_50V_5%_X7R; Case: 0805; Mounted: Yes; Socket: No; SMD: Yes; Manufacturer1 Example: AVX; Manufacturer1 ComponentHeight: 0.94mm; HelpURL: \\cern.ch\dfs\Applications\Altium\Datasheets\CC0805_X7R_AVX.pdf; Author: CERN DEM JLC; CreateDate: 18.01.2011; LatestRevisionDate: 18.01.2011
C28 = CAER_220UF_25V_20%_RUBYCON_25YXF220M8X11.5: Polarised capacitor; Part Description: Radial Miniature, Aluminum Electrolytic Capacitor, (YXF Series); Voltage: 25V; Tolerance: ±20%; Table: Capacitors THD; Part Number: CAER_220UF_25V_20%_RUBYCON_25YXF220M8X11.5; Component Kind: Standard; Component Type: Standard; Pin Count: 2; Value: 220uF; Status: None; Manufacturer: RUBYCON; Manufacturer Part Number: 25YXF220M8X11.5; Case: LS3.5 D8.5 x H13; Mounted: Yes; Socket: No; SMD: No; ComponentHeight: 13mm; HelpURL: \\cern.ch\dfs\Applications\Altium\Datasheets\CAER_RUBYCON_YXF.pdf; Author: CERN DEM JLC; CreateDate: 20.08.2009; LatestRevisionDate: 17.09.2009
D3 = BZV55-B3V6: Zener Diode; Part Description: Voltage Regulator Diode; Manufacturer: NXP SEMICONDUCTORS; Voltage: 3V6; Power: 500mW; Table: Diodes; Part Number: BZV55-B3V6; Component Kind: Standard; Component Type: Standard; Device: BZV55-B3V6; PackageDescription: SOD80C, MELF Diode, 2-Leads, Body 3.5x1.5mm, IPC Medium Density; Manufacturer Part Number: BZV55-B3V6; Pin Count: 2; Case: SOD-80C; Mounted: Yes; Socket: No; SMD: Yes; ComponentHeight: 1.6mm; HelpURL: \\cern.ch\dfs\Applications\Altium\Datasheets\BZV55.pdf; Author: CERN DEM JLC; CreateDate: 06.05.2008; LatestRevisionDate: 06.05.2008
D4 = BAS416: as D1 on sheet CPUBoard_p1; Part Number: BAS416; Component Kind: Standard; Component Type: Standard; Device: BAS416; PackageDescription: Small Outline Diode Flat Lead (SOD-323), 1.70mm W X 1.25mm L X 1.10mm H body,  IPC Medium Density; Manufacturer Part Number: BAS416; Pin Count: 2; Case: SOD323; Mounted: Yes; Socket: No; SMD: Yes; ComponentHeight: 1.1mm; HelpURL: \\cern.ch\dfs\Applications\Altium\Datasheets\BAS416.pdf; Author: CERN DEM JLC; CreateDate: 01.10.2013; LatestRevisionDate: 01.10.2013
J2-J4 = MOLEX_22-04-1031: Connector 3 Male; Part Description: 2.5mm (.100") Pitch KK® Wire-to-Board Header, Vertical, with Friction Lock, 3 Circuits, Tin (Sn) Plating; Manufacturer: MOLEX; Part Number: MOLEX_22-04-1031; Component Kind: Standard; Component Type: Standard; Pin Count: 3; Family: KK®; Mounted: Yes; Socket: No; SMD: No; Status: None; Manufacturer Part Number: 22-04-1031; ComponentHeight: 11.7mm; HelpURL: \\cern.ch\dfs\Applications\Altium\Datasheets\MOLEX_22-04-1031.pdf; Author: CERN DEM JLC; CreateDate: 09.02.2012; LatestRevisionDate: 09.02.2012; Table: MOLEX
J5 = MOLEX_22-27-2061: Connector 6 Male; Part Description: 2.54mm (.100") Pitch KK® Wire-to-Board Header, Vertical, with Friction Lock, 6 Circuits, Tin (Sn) Plating; Manufacturer: MOLEX; Part Number: MOLEX_22-27-2061; Component Kind: Standard; Component Type: Standard; Pin Count: 6; Family: KK®; Mounted: Yes; Socket: No; SMD: No; Status: None; Manufacturer Part Number: 22-27-2061; ComponentHeight: 11.7mm; HelpURL: \\cern.ch\dfs\Applications\Altium\Datasheets\MOLEX_22-27-2061.pdf; Author: CERN DEM JMW; CreateDate: 30.11.2011; LatestRevisionDate: 30.11.2011; Table: MOLEX
J6 = MOLEX_70246-1004: Connector 10 Male; Part Description: 2.54mm Pitch C-Grid® Header, Low Profile, Dual Row, Vertical, Shrouded Header; Manufacturer: MOLEX; Part Number: MOLEX_70246-1004; Component Kind: Standard; Component Type: Standard; Pin Count: 10; Family: C-Grid®; Mounted: Yes; Socket: No; SMD: No; Status: None; Manufacturer Part Number: 70246-1004; ComponentHeight: 9.27mm; HelpURL: \\cern.ch\dfs\Applications\Altium\Datasheets\MOLEX_70246-1004.pdf; Author: CERN DEM JLC; CreateDate: 14.08.2013; LatestRevisionDate: 14.08.2013; Table: MOLEX
R16 R17 R23 R26 R27 = R0805_4K7_1%_0.125W_100PPM: as R7 on sheet CPUBoard_p1; Part Number: R0805_4K7_1%_0.125W_100PPM; Component Kind: Standard; Component Type: Standard; Pin Count: 2; Value: 4k7; Status: Preferred; Tolerance: ±1%; Manufacturer Part Number: R0805_4K7_1%_0.125W_100PPM; Case: 0805; Mounted: Yes; Socket: No; SMD: Yes; Manufacturer1 Example: NIC COMPONENT; Manufacturer1 ComponentHeight: 0.6mm; HelpURL: \\cern.ch\dfs\Applications\Altium\Datasheets\R0805_NIC_NRC.pdf; Author: CERN DEM JLC; CreateDate: 03.12.2007; LatestRevisionDate: 13.03.2008
R18 R21 R24 R25 = R0805_220R_1%_0.125W_100PPM: Resistor - 1%; Part Description: General Purpose Thick Film Chip Resistor; Manufacturer: GENERIC; Manufacturer1 Part Number: NRC10F2200TRF; Power: 0.125W; TC: ±100ppm/°C; Table: Resistors SMD; Part Number: R0805_220R_1%_0.125W_100PPM; Component Kind: Standard; Component Type: Standard; Pin Count: 2; Value: 220; Status: Preferred; Tolerance: ±1%; Manufacturer Part Number: R0805_220R_1%_0.125W_100PPM; Case: 0805; Mounted: Yes; Socket: No; SMD: Yes; Manufacturer1 Example: NIC COMPONENT; Manufacturer1 ComponentHeight: 0.6mm; HelpURL: \\cern.ch\dfs\Applications\Altium\Datasheets\R0805_NIC_NRC.pdf; Author: CERN DEM JLC; CreateDate: 03.12.2007; LatestRevisionDate: 13.03.2008
R19 = R0805_1K2_1%_0.125W_100PPM: Resistor - 1%; Part Description: General Purpose Thick Film Chip Resistor; Manufacturer: GENERIC; Manufacturer1 Part Number: NRC10F1201TRF; Power: 0.125W; TC: ±100ppm/°C; Table: Resistors SMD; Part Number: R0805_1K2_1%_0.125W_100PPM; Component Kind: Standard; Component Type: Standard; Pin Count: 2; Value: 1k2; Status: Preferred; Tolerance: ±1%; Manufacturer Part Number: R0805_1K2_1%_0.125W_100PPM; Case: 0805; Mounted: Yes; Socket: No; SMD: Yes; Manufacturer1 Example: NIC COMPONENT; Manufacturer1 ComponentHeight: 0.6mm; HelpURL: \\cern.ch\dfs\Applications\Altium\Datasheets\R0805_NIC_NRC.pdf; Author: CERN DEM JLC; CreateDate: 03.12.2007; LatestRevisionDate: 13.03.2008
R20 = R0805_2K32_0.1%_0.1W_10PPM: Resistor - 0.1%; Part Description: Thin Film Chip Resistor; Manufacturer: GENERIC; Manufacturer1 Part Number: RN73C2A2K32BTG; Power: 0.1W; TC: ±10ppm; Table: Resistors SMD; Part Number: R0805_2K32_0.1%_0.1W_10PPM; Component Kind: Standard; Component Type: Standard; Pin Count: 2; Value: 2k32; Status: Not recommended; Tolerance: ±0.1%; Manufacturer Part Number: R0805_2K32_0.1%_0.1W_10PPM; Case: 0805; Mounted: Yes; Socket: No; SMD: Yes; Manufacturer1 Example: TYCO HOLSWORTHY; Manufacturer1 ComponentHeight: 0.6mm; HelpURL: \\cern.ch\dfs\Applications\Altium\Datasheets\R0805_Tyco_RN73.pdf; Author: CERN DEM JLC; CreateDate: 03.12.2007; LatestRevisionDate: 13.03.2008
R22 = R0805_10K_0.1%_0.1W_10PPM: Resistor - 0.1%; Part Description: Thin Film Chip Resistor; Manufacturer: GENERIC; Manufacturer1 Part Number: RN73C2A10KBTG; Power: 0.1W; TC: ±10ppm; Table: Resistors SMD; Part Number: R0805_10K_0.1%_0.1W_10PPM; Component Kind: Standard; Component Type: Standard; Pin Count: 2; Value: 10k; Status: Not recommended; Tolerance: ±0.1%; Manufacturer Part Number: R0805_10K_0.1%_0.1W_10PPM; Case: 0805; Mounted: Yes; Socket: No; SMD: Yes; Manufacturer1 Example: TYCO HOLSWORTHY; Manufacturer1 ComponentHeight: 0.6mm; HelpURL: \\cern.ch\dfs\Applications\Altium\Datasheets\R0805_Tyco_RN73.pdf; Author: CERN DEM JLC; CreateDate: 03.12.2007; LatestRevisionDate: 13.03.2008
R28 = R0805_100K_0.1%_0.1W_10PPM: Resistor - 0.1%; Part Description: Thin Film Chip Resistor; Manufacturer: GENERIC; Manufacturer1 Part Number: RN73C2A100KBTG; Power: 0.1W; TC: ±10ppm; Table: Resistors SMD; Part Number: R0805_100K_0.1%_0.1W_10PPM; Component Kind: Standard; Component Type: Standard; Pin Count: 2; Value: 100k; Status: Not recommended; Tolerance: ±0.1%; Manufacturer Part Number: R0805_100K_0.1%_0.1W_10PPM; Case: 0805; Mounted: Yes; Socket: No; SMD: Yes; Manufacturer1 Example: TYCO HOLSWORTHY; Manufacturer1 ComponentHeight: 0.6mm; HelpURL: \\cern.ch\dfs\Applications\Altium\Datasheets\R0805_Tyco_RN73.pdf; Author: CERN DEM JLC; CreateDate: 03.12.2007; LatestRevisionDate: 13.03.2008
R29-R31 R34 = R0805_22R_1%_0.125W_100PPM: as R4 on sheet CPUBoard_p1; Part Number: R0805_22R_1%_0.125W_100PPM; Component Kind: Standard; Component Type: Standard; Pin Count: 2; Value: 22; Status: Preferred; Tolerance: ±1%; Manufacturer Part Number: R0805_22R_1%_0.125W_100PPM; Case: 0805; Mounted: Yes; Socket: No; SMD: Yes; Manufacturer1 Example: NIC COMPONENT; Manufacturer1 ComponentHeight: 0.6mm; HelpURL: \\cern.ch\dfs\Applications\Altium\Datasheets\R0805_NIC_NRC.pdf; Author: CERN DEM JLC; CreateDate: 03.12.2007; LatestRevisionDate: 13.03.2008
R32 R33 = R0805_10K_1%_0.125W_100PPM: Resistor - 1%; Part Description: General Purpose Thick Film Chip Resistor; Manufacturer: GENERIC; Manufacturer1 Part Number: NRC10F1002TRF; Power: 0.125W; TC: ±100ppm/°C; Table: Resistors SMD; Part Number: R0805_10K_1%_0.125W_100PPM; Component Kind: Standard; Component Type: Standard; Pin Count: 2; Value: 10k; Status: Preferred; Tolerance: ±1%; Manufacturer Part Number: R0805_10K_1%_0.125W_100PPM; Case: 0805; Mounted: Yes; Socket: No; SMD: Yes; Manufacturer1 Example: NIC COMPONENT; Manufacturer1 ComponentHeight: 0.6mm; HelpURL: \\cern.ch\dfs\Applications\Altium\Datasheets\R0805_NIC_NRC.pdf; Author: CERN DEM JLC; CreateDate: 03.12.2007; LatestRevisionDate: 13.03.2008
T2 T3 = BC847B: NPN Transistor; Part Description: 45V 100mA NPN general-purpose transistors; Manufacturer: NXP SEMICONDUCTORS; Table: Transistors; Part Number: BC847B; Component Kind: Standard; Component Type: Standard; Device: BC847B; PackageDescription: SOT23, 3 pin, Pitch 0.95mm - 1.3mm W X 2.9mm L X 1.1mm H, IPC Medium Density; Manufacturer Part Number: BC847B; Pin Count: 3; Case: SOT23-3; Mounted: Yes; Socket: No; SMD: Yes; ComponentHeight: 1.1mm; HelpURL: \\cern.ch\dfs\Applications\Altium\Datasheets\BC847B.pdf; Author: CERN DEM JLC; CreateDate: 14.06.2011; LatestRevisionDate: 14.06.2011
U3 = SST25VF016B-75-4I-S2AF: 16 Mbit SPI Serial Flash, 2.7 to 3.6 V, 80 MHz, -40 to 85 degC, 8-pin SOIC (S2A8), Tube; Manufacturer: Microchip; DatasheetVersion: Rev. A; PackageVersion: Rev. A; PackageReference: SOIC-S2A8; PackageDescription: 8-Lead Plastic Small Outline Intergrated Circuit, 5.275 x 5.275 mm Body, 1.27 mm Pitch; Supplier 1: Digi-Key; Supplier Part Number 1: SST25VF016B-75-4I-S2AF-ND; Supplier 2: Farnell; Supplier Part Number 2: 1829951; Supplier 3: Newark; Supplier Part Number 3: 82R4475; Supplier 4: Mouser; Supplier Part Number 4: 579-25VF016B7IS2AF; Mounting Technology: Surface Mount; PartNumber: SST25VF016B-75-4I-S2AF; ComponentLink1Description: Manufacturer URL; ComponentLink1URL: http://www.microchip.com; ComponentLink2Description: Datasheet; ComponentLink2URL: http://ww1.microchip.com/downloads/en/DeviceDoc/25044A.pdf; ComponentLink3Description: Package Specification; ComponentLink3URL: http://ww1.microchip.com/downloads/en/DeviceDoc/25051A.pdf; ComponentLink4Description: Product URL; ComponentLink4URL: http://www.microchip.com/SST25VF016B
U4 = LD1117AS12TR: 1A, Low Drop Positive Voltage Regulator, 1.2V, 4-Pin SOT-223, Tape and Reel; DatasheetVersion: Dec-2011; PackageVersion: 2010; PackageReference: SOT-223; PackageDescription: 4-Pin SOT-223 Package, 6.5 x 3.5 mm Body, 2.3 mm Pitch, 7 mm Lead Span; PartNumber: LD1117AS12TR; ComponentLink1Description: Manufacturer URL; ComponentLink1URL: http://www.st.com; ComponentLink2Description: Datasheet; ComponentLink2URL: http://www.st.com/internet/com/TECHNICAL_RESOURCES/TECHNICAL_LITERATURE/DATASHEET/CD00002116.pdf
H1 = H-1x5: Price: 0.05
H2 = H-2x20: Price: 0.40
H3 = H-2x4: Price: 0.08